# Altium schematic sheet HumRigid1_mech.SchDoc
size A4; SheetNumber: 2; SheetTotal: 2
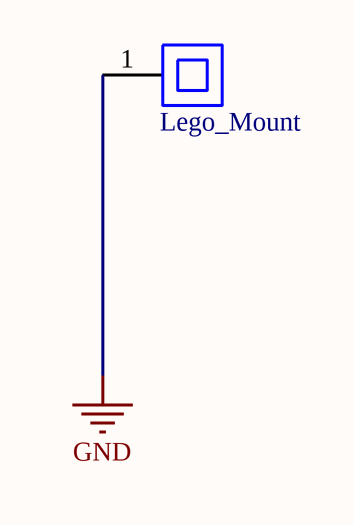
[diagram p0: HumRigid1_mech.SchDoc]

## Parts
M1  Lego_Mount  [Lego_Mount]

## Nets
GND: M1.1